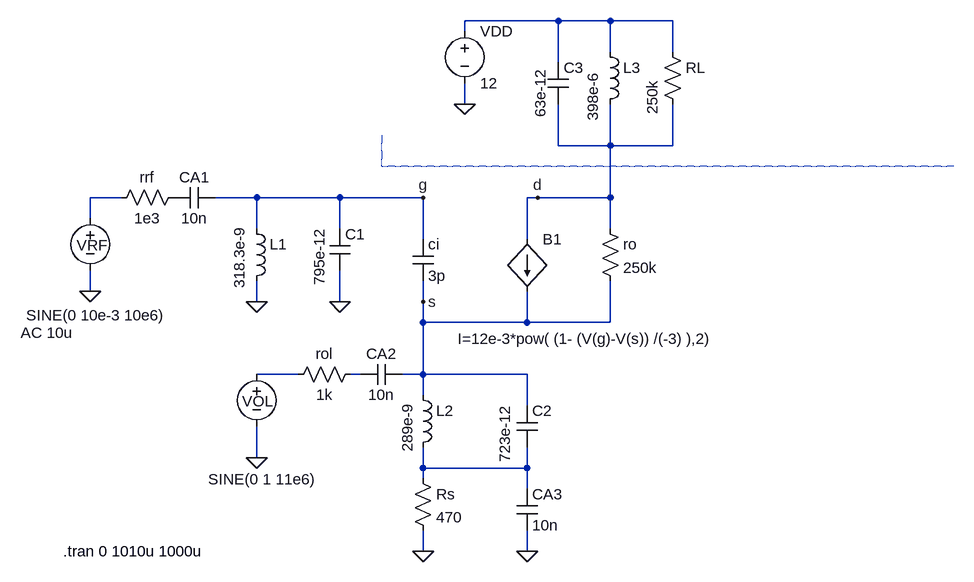
[diagram p0: schematic jfet_modelo.asc]
jfet_modelo.asc, the LTspice schematic file:
Version 4
SHEET 1 884 680
WIRE 272 -400 128 -400
WIRE 352 -400 272 -400
WIRE 448 -400 352 -400
WIRE 128 -384 128 -400
WIRE 352 -352 352 -400
WIRE 448 -352 448 -400
WIRE 272 -336 272 -400
WIRE 128 -272 128 -304
WIRE 272 -208 272 -272
WIRE 352 -208 352 -272
WIRE 352 -208 272 -208
WIRE 448 -208 448 -272
WIRE 448 -208 352 -208
WIRE -400 -128 -448 -128
WIRE -192 -128 -256 -128
WIRE -64 -128 -192 -128
WIRE 64 -128 -64 -128
WIRE 240 -128 224 -128
WIRE 352 -128 352 -208
WIRE 352 -128 240 -128
WIRE -448 -96 -448 -128
WIRE -192 -80 -192 -128
WIRE -64 -80 -64 -128
WIRE 352 -80 352 -128
WIRE 64 -64 64 -128
WIRE 224 -64 224 -128
WIRE -448 16 -448 -16
WIRE -192 32 -192 0
WIRE -64 32 -64 -16
WIRE 64 32 64 0
WIRE 64 64 64 32
WIRE 224 64 224 16
WIRE 224 64 64 64
WIRE 352 64 352 0
WIRE 352 64 224 64
WIRE -128 144 -192 144
WIRE -32 144 -48 144
WIRE 64 144 64 64
WIRE 64 144 32 144
WIRE 224 144 64 144
WIRE 64 176 64 144
WIRE 224 192 224 144
WIRE -192 272 -192 224
WIRE 64 288 64 256
WIRE 224 288 224 256
WIRE 224 288 64 288
WIRE 64 304 64 288
WIRE 224 320 224 288
WIRE 64 416 64 384
WIRE 224 416 224 384
FLAG 64 416 0
FLAG -192 272 0
FLAG -448 16 0
FLAG -192 32 0
FLAG -64 32 0
FLAG 64 -128 g
FLAG 64 32 s
FLAG 224 416 0
FLAG 128 -272 0
FLAG 240 -128 d
SYMBOL ind 48 160 R0
WINDOW 3 -8 103 VLeft 2
SYMATTR InstName L2
SYMATTR Value 289e-9
SYMBOL cap 208 192 R0
WINDOW 3 -18 87 VLeft 2
SYMATTR InstName C2
SYMATTR Value 723e-12
SYMBOL cap 32 128 R90
WINDOW 0 0 32 VBottom 2
WINDOW 3 32 32 VTop 2
SYMATTR InstName CA2
SYMATTR Value 10n
SYMBOL voltage -192 128 R0
WINDOW 123 0 0 Left 0
WINDOW 39 0 0 Left 0
WINDOW 0 -22 57 Left 2
WINDOW 3 -75 177 Left 2
SYMATTR InstName VOL
SYMATTR Value SINE(0 1 11e6)
SYMBOL res -304 -144 R90
WINDOW 0 0 56 VBottom 2
WINDOW 3 32 56 VTop 2
SYMATTR InstName rrf
SYMATTR Value 1e3
SYMBOL cap -256 -144 R90
WINDOW 0 0 32 VBottom 2
WINDOW 3 32 32 VTop 2
SYMATTR InstName CA1
SYMATTR Value 10n
SYMBOL cap -80 -80 R0
WINDOW 3 -16 87 VLeft 2
SYMATTR InstName C1
SYMATTR Value 795e-12
SYMBOL ind -208 -96 R0
WINDOW 3 -11 108 VLeft 2
SYMATTR InstName L1
SYMATTR Value 318.3e-9
SYMBOL cap 48 -64 R0
SYMATTR InstName ci
SYMATTR Value 3p
SYMBOL bi 224 -64 R0
WINDOW 3 -107 153 Left 2
SYMATTR InstName B1
SYMATTR Value I=12e-3*pow( (1- (V(g)-V(s)) /(-3) ),2)
SYMBOL ind 336 -368 R0
WINDOW 3 -11 122 VLeft 2
SYMATTR InstName L3
SYMATTR Value 398e-6
SYMBOL res 336 -96 R0
SYMATTR InstName ro
SYMATTR Value 250k
SYMBOL cap 256 -336 R0
WINDOW 3 -12 85 VLeft 2
SYMATTR InstName C3
SYMATTR Value 63e-12
SYMBOL res 432 -368 R0
WINDOW 3 -15 112 VLeft 2
SYMATTR InstName RL
SYMATTR Value 250k
SYMBOL voltage -448 -112 R0
WINDOW 123 -107 192 Left 2
WINDOW 39 0 0 Left 0
WINDOW 0 -21 57 Left 2
WINDOW 3 -99 165 Left 2
SYMATTR Value2 AC 10u
SYMATTR InstName VRF
SYMATTR Value SINE(0 10e-3 10e6)
SYMBOL res 48 288 R0
SYMATTR InstName Rs
SYMATTR Value 470
SYMBOL cap 208 320 R0
SYMATTR InstName CA3
SYMATTR Value 10n
SYMBOL res -32 128 R90
WINDOW 0 0 56 VBottom 2
WINDOW 3 32 56 VTop 2
SYMATTR InstName rol
SYMATTR Value 1k
SYMBOL voltage 128 -400 R0
WINDOW 123 0 0 Left 0
WINDOW 39 0 0 Left 0
SYMATTR InstName VDD
SYMATTR Value 12
TEXT -490 416 Left 2 !.tran 0 1010u 1000u
RECTANGLE Normal 0 -176 0 -176 2
RECTANGLE Normal 0 -224 0 -176 2
RECTANGLE Normal 880 -176 0 -176 2

The netlist it stands for:
* jfet_modelo.asc
L2 s N005 289e-9
C2 s N005 723e-12
CA2 s N004 10n
VOL N003 0 SINE(0 1 11e6)
rrf P001 N002 1e3
CA1 g P001 10n
C1 g 0 795e-12
L1 g 0 318.3e-9
ci g s 3p
B1 d s I=12e-3*pow( (1- (V(g)-V(s)) /(-3) ),2)
L3 N001 d 398e-6
ro d s 250k
C3 N001 d 63e-12
RL N001 d 250k
VRF N002 0 SINE(0 10e-3 10e6) AC 10u
Rs N005 0 470
CA3 N005 0 10n
rol N004 N003 1k
VDD N001 0 12
.tran 0 1010u 1000u
.backanno
.end